# Altium project PowerBoard.PrjPCB (part 3 of 3)

## Sheet CurrentSens.SchDoc: Current Sensors
size A4; DrawnBy: Jarod Krane; Organization: Altium Limited; Address1: L3, 12a Rodborough Rd; Address2: Frenchs Forest; Address3: NSW; Address4: Australia 2086; Revision: 0; SheetNumber: 9; SheetTotal: 11
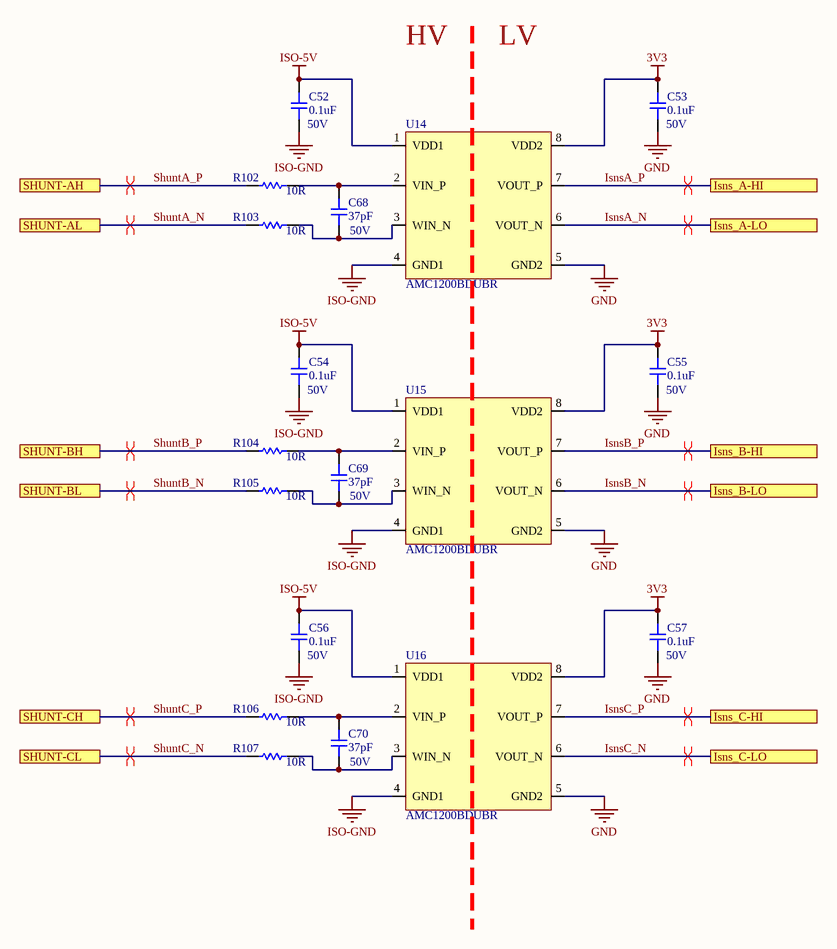
[diagram p10: CurrentSens.SchDoc]

### Parts
C52  0.1uF  Voltage: 50V  [CAP-0805]
C53  0.1uF  Voltage: 50V  [CAP-0805]
C54  0.1uF  Voltage: 50V  [CAP-0805]
C55  0.1uF  Voltage: 50V  [CAP-0805]
C56  0.1uF  Voltage Rating: 50V  [CAP-0805]
C57  0.1uF  Voltage: 50V  [CAP-0805]
C68  37pF  Voltage: 50V  [CAP-0805]
C69  37pF  Voltage: 50V  [CAP-0805]
C70  37pF  Voltage: 50V  [CAP-0805]
R102  10R  [RES-0603]
R103  10R  [RES-0603]
R104  10R  [RES-0603]
R105  10R  [RES-0603]
R106  10R  [RES-0603]
R107  10R  [RES-0603]
U14  AMC1200BDUBR  [8-SOP]
U15  AMC1200BDUBR  [8-SOP]
U16  AMC1200BDUBR  [8-SOP]

### Ports
Isns_A-HI, Isns_A-LO, Isns_B-HI, Isns_B-LO, Isns_C-HI, Isns_C-LO, SHUNT-AH, SHUNT-AL, SHUNT-BH, SHUNT-BL, SHUNT-CH, SHUNT-CL

### Nets
3V3: C53.2 C55.2 C57.2 U14.8(VDD2) U15.8(VDD2) U16.8(VDD2)
GND: C53.1 C55.1 C57.1 U14.5(GND2) U15.5(GND2) U16.5(GND2)
ISO-5V: C52.2 C54.2 C56.2 U14.1(VDD1) U15.1(VDD1) U16.1(VDD1)
ISO-GND: C52.1 C54.1 C56.1 U14.4(GND1) U15.4(GND1) U16.4(GND1)
IsnsA_N: U14.6(VOUT_N) ; port Isns_A-LO
IsnsA_P: U14.7(VOUT_P) ; port Isns_A-HI
IsnsB_N: U15.6(VOUT_N) ; port Isns_B-LO
IsnsB_P: U15.7(VOUT_P) ; port Isns_B-HI
IsnsC_N: U16.6(VOUT_N) ; port Isns_C-LO
IsnsC_P: U16.7(VOUT_P) ; port Isns_C-HI
ShuntA_N: R103.2 ; port SHUNT-AL
ShuntA_P: R102.2 ; port SHUNT-AH
ShuntB_N: R105.2 ; port SHUNT-BL
ShuntB_P: R104.2 ; port SHUNT-BH
ShuntC_N: R107.2 ; port SHUNT-CL
ShuntC_P: R106.2 ; port SHUNT-CH
NetC68_1: C68.1 R103.1 U14.3(WIN_N)
NetC68_2: C68.2 R102.1 U14.2(VIN_P)
NetC69_1: C69.1 R105.1 U15.3(WIN_N)
NetC69_2: C69.2 R104.1 U15.2(VIN_P)
NetC70_1: C70.1 R107.1 U16.3(WIN_N)
NetC70_2: C70.2 R106.1 U16.2(VIN_P)

### Layout directives
differential pair: IsnsA_N, IsnsA_P, IsnsB_N, IsnsB_P, IsnsC_N, IsnsC_P, ShuntA_N, ShuntA_P, ShuntB_N, ShuntB_P, ShuntC_N, ShuntC_P

### Notes on the sheet
- HV
- LV
- Title
- Size:
- Date:
- A4
- Number:
- Time:
- Revision:
- Sheet
- of
- File:

### Library data of the parts
C52-C57 = 0805-0.1uF-50V: CAP CER 0.1UF 50V Y5V 0805; Manufacturer: KEMET; Manufacturer Part Number: C0805C104Z5VACTU; Dielectric Material: Ceramic; Capacitance: 100nF; Tolerance: 80%; Dissipation Factor: 5%; Supplier 1: Digi-Key; Stock 1: 929243; Pricing 1: 1=0.1, 10=0.057, 100=0.0254, 500=0.01818, 1000=0.01428 (USD); Mount: Surface Mount,PCB; Case/Package: 0805; Number of Pins: 2; Case Code (Metric): 2012; Case Code (Imperial): 0805; Min Operating Temperature: -30°C; Max Operating Temperature: 85°C; Package Quantity: 1; Packaging: Tape and Reel; Voltage Rating (DC): 50V; Dielectric: Y5V; Termination: SMD/SMT; Length: 2mm; Height: 0.9mm; Lead Pitch: 0.75mm; Width: 0.049inch; Thickness: 0.039inch; Depth: 1.25mm; Radiation Hardening: No; REACH SVHC: No SVHC; Lead Free: Lead Free; ComponentLink1URL: http://www.alliedelec.com/m/d/9bfe7773041ffe9d406e68bc7b377fdd.pdf?src-supplier=Allied+Electronics; ComponentLink1Description: http://www.alliedelec.com/m/d/9bfe7773041ffe9d406e68bc7b377fdd.pdf?src-supplier=Allied+Electronics; ComponentLink2URL: https://www.verical.com/server-webapp/html/getDatasheet?partID=37101&src-supplier=Verical; ComponentLink2Description: https://www.verical.com/server-webapp/html/getDatasheet?partID=37101&src-supplier=Verical; ComponentLink3URL: https://www.verical.com/server-webapp/html/getDatasheet?partID=321176&src-supplier=Verical; ComponentLink3Description: https://www.verical.com/server-webapp/html/getDatasheet?partID=321176&src-supplier=Verical; ComponentLink4URL: http://www.farnell.com/datasheets/2123124.pdf?src-supplier=Element14; ComponentLink4Description: http://www.farnell.com/datasheets/2123124.pdf?src-supplier=Element14; Supplier Part Number 1: 399-1177-6-ND
  C52-C55 C57: Voltage Rating: 50V
  C56: Voltage: 50V
C68-C70 = 0805-39pF-50V: CAP CER 39PF 50V C0G/NP0 0805; Manufacturer: Samsung; Manufacturer Part Number: CL21C390JBANNNC; Material: Ceramic; Tolerance: 5%; Dielectric: C0G; Temperature Coefficient: 300ppm/°C; Supplier 1: Digi-Key; Stock 1: 62860; Pricing 1: 1=0.1, 10=0.045, 50=0.0248, 100=0.0202, 500=0.01444, 1000=0.01135 (USD); Mount: Surface Mount; Case/Package: 0805; Case Code (Metric): 2012; Case Code (Imperial): 0805; Min Operating Temperature: -55°C; Max Operating Temperature: 125°C; Package Quantity: 1; Packaging: Tape and Reel; Voltage Rating: 50V; Series: CL; Construction: Flat; Length: 2mm; Width: 0.049inch; Height: 0.65mm; Thickness: 0.03inch; Depth: 1.25mm; Radiation Hardening: No; RoHS Compliant: Yes; ComponentLink1URL: http://www1.futureelectronics.com/doc/SAMSUNG%20PASSIVE/CL05B104KQ5NNNC.pdf?src-supplier=Future+Electronics; ComponentLink1Description: http://www1.futureelectronics.com/doc/SAMSUNG%20PASSIVE/CL05B104KQ5NNNC.pdf?src-supplier=Future+Electronics; ComponentLink2URL: https://www.verical.com/server-webapp/html/getDatasheet?partID=480498&src-supplier=Verical; ComponentLink2Description: https://www.verical.com/server-webapp/html/getDatasheet?partID=480498&src-supplier=Verical; ComponentLink3URL: https://produktinfo.conrad.com/datenblaetter/450000-474999/454441-da-01-en-VS_KONDENSATOR_0805.pdf?src-supplier=Conrad; ComponentLink3Description: https://produktinfo.conrad.com/datenblaetter/450000-474999/454441-da-01-en-VS_KONDENSATOR_0805.pdf?src-supplier=Conrad; Supplier Part Number 1: 1276-1769-1-ND; Capacitance: 39pF
R102-R107 = 0603-10R: RES SMD 10 OHM 1% 1/10W 0603; Manufacturer: Yageo; Manufacturer Part Number: RC0603FR-0710RL; Voltage Rating (DC): 50V; Temperature Coefficient: 200ppm/°C; Power Rating: 100mW; Supplier 1: Digi-Key; Stock 1: 11151092; Pricing 1: 1=0.1, 10=0.046, 100=0.0187, 1000=0.0084, 2500=0.00729 (USD); Case/Package: 0603; Number of Pins: 2; Case Code (Imperial): 0603; Case Code (Metric): 1608; Contact Plating: Tin,Matte; Min Operating Temperature: -55°C; Max Operating Temperature: 155°C; Packaging: Tape and Reel; Resistance: 10R; Tolerance: 1%; Composition: Thick Film; Voltage Rating: 50V; Termination: SMD/SMT; Military Standard: Not; Length: 1.6mm; Height: 0.45mm; Width: 0.8mm; Depth: 0.8mm; Radiation Hardening: No; REACH SVHC: No SVHC; Lead Free: Lead Free; ComponentLink1URL: http://www.farnell.com/datasheets/1868787.pdf?src-supplier=Element14; ComponentLink1Description: http://www.farnell.com/datasheets/1868787.pdf?src-supplier=Element14; ComponentLink2URL: http://www.yageo.com/documents/recent/PYu-RC0603_51_RoHS_L_4.pdf?src-supplier=Avnet; ComponentLink2Description: http://www.yageo.com/documents/recent/PYu-RC0603_51_RoHS_L_4.pdf?src-supplier=Avnet; ComponentLink3URL: http://documents.rs-components.com/techlib://itc_doclist_GB.htm?stockno=5048984&src-supplier=RSComponents; ComponentLink3Description: http://documents.rs-components.com/techlib://itc_doclist_GB.htm?stockno=5048984&src-supplier=RSComponents; ComponentLink4URL: http://www.yageo.com/documents/recent/PYu-RC0603_51_RoHS_L_4.pdf?src-supplier=Avnet+Europe; ComponentLink4Description: http://www.yageo.com/documents/recent/PYu-RC0603_51_RoHS_L_4.pdf?src-supplier=Avnet+Europe; Supplier Part Number 1: 311-10.0HRDKR-ND
U14-U16 = ISO-OPAMP: IC OPAMP ISOLATION 1 CIRC 8SOP; Manufacturer: Texas Instruments; Number of Channels: 1; Common Mode Rejection Ratio: 95dB; Operating Supply Voltage: 5.5V; -3db Bandwidth: 100kHz; Nominal Supply Current: 5.4mA; Output Current: 20mA; Max Input Voltage: 320mV; Input Offset Voltage (Vos): 200uV; Power Dissipation: 44mW; Power Supply Rejection Ratio (PSRR): 61dB; Dual Supply Voltage: 5V; Power Consumption: 82.5mW; Supplier 1: Digi-Key; Manufacturer Part Number: AMC1200BDUBR; Stock 1: 0; Pricing 1: 1=4.92, 10=4.415, 25=4.1736, 100=3.6172 (USD); Mount: Surface Mount; Case/Package: SOP; Number of Pins: 8; Min Operating Temperature: -40°C; Max Operating Temperature: 105°C; Max Dual Supply Voltage: 5.5V; Packaging: Tape and Reel; Package Quantity: 350; Bandwidth: 100kHz; Number of Circuits: 1; Operating Supply Current: 5.4mA; Output Current per Channel: 20mA; Max Power Dissipation: 44mW; Number of Elements: 1; Series: -; Amplifier Type: ISOLATION; Supply Current: 5.4mA; Lead Free: Lead Free; RoHS Compliant: Yes; ComponentLink1URL: http://www.ti.com/general/docs/lit/getliterature.tsp?genericPartNumber=AMC1200&&fileType=pdf&src-supplier=Avnet; ComponentLink1Description: http://www.ti.com/general/docs/lit/getliterature.tsp?genericPartNumber=AMC1200&&fileType=pdf&src-supplier=Avnet; ComponentLink2URL: http://www.ti.com/lit/ds/symlink/amc1200.pdf?src-supplier=Digi-Key; ComponentLink2Description: http://www.ti.com/lit/ds/symlink/amc1200.pdf?src-supplier=Digi-Key; Supplier Part Number 1: 296-38868-6-ND

## Nets that join several sheets
3V3: Sensors (C51.2 U13.8), Connectors (J2.17), CurrentSens (6 pins)
5V: PhaseALeg (6 pins), PhaseBLeg (6 pins), PhaseCLeg (6 pins), Sensors (R40.2 R41.2 R42.2), Connectors (J2.7 J2.19)
12V: PhaseALeg (C2.2 C10.2 U1.1 U3.1), PhaseBLeg (C18.2 C26.2 U5.1 U7.1), PhaseCLeg (C34.2 C43.2 U9.1 U11.1), AIRControl (C59.2 U18.5), Connectors (J2.9 J2.21)
GND: PhaseALeg (10 pins), PhaseBLeg (10 pins), PhaseCLeg (10 pins), Sensors (5 pins), AIRControl (C59.1 U18.3), Connectors (7 pins), CurrentSens (6 pins)
HV+: U_PhaseALeg/HA (7 pins), U_PhaseBLeg/HB (7 pins), U_PhaseCLeg/HC (7 pins), Sensors (R50.2), AIRControl (8 pins), Connectors (7 pins)
HV-GND: PhaseALeg (C66.2 R4.1), PhaseBLeg (C67.2 R17.1), PhaseCLeg (C39.2 R30.1), Sensors (R51.1 U13.3), AIRControl (Q22.3 R60.1), Connectors (7 pins)
ISO-5V: Sensors (C50.2 U13.1), Connectors (J7.2), CurrentSens (6 pins)
ISO-GND: Sensors (C50.1 U13.4), Connectors (J7.1), CurrentSens (6 pins)
A-HI-CLAMP: PhaseALeg (U2.6), U_PhaseALeg/HA (14 pins)
A-HI-GATE: PhaseALeg (U2.7), U_PhaseALeg/HA (7 pins)
A-HIGH: PhaseALeg (R2.1 R6.1), Connectors (J2.3)
A-LO-CLAMP: PhaseALeg (U4.6), U_PhaseALeg/LA (14 pins)
A-LO-GATE: PhaseALeg (U4.7), U_PhaseALeg/LA (7 pins)
A-LOW: PhaseALeg (R3.1 R5.1), Connectors (J2.4)
B-HI-CLAMP: PhaseBLeg (U6.6), U_PhaseBLeg/HB (14 pins)
B-HI-GATE: PhaseBLeg (U6.7), U_PhaseBLeg/HB (7 pins)
B-HIGH: PhaseBLeg (R15.1 R19.1), Connectors (J2.16)
B-LO-CLAMP: PhaseBLeg (U8.6), U_PhaseBLeg/LB (14 pins)
B-LO-GATE: PhaseBLeg (U8.7), U_PhaseBLeg/LB (7 pins)
B-LOW: PhaseBLeg (R16.1 R18.1), Connectors (J2.15)
C-HI-CLAMP: PhaseCLeg (U10.6), U_PhaseCLeg/HC (14 pins)
C-HI-GATE: PhaseCLeg (U10.7), U_PhaseCLeg/HC (7 pins)
C-HIGH: PhaseCLeg (R28.1 R32.1), Connectors (J2.29)
C-LO-CLAMP: PhaseCLeg (U12.6), U_PhaseCLeg/LC (14 pins)
C-LO-GATE: PhaseCLeg (U12.7), U_PhaseCLeg/LC (7 pins)
C-LOW: PhaseCLeg (R29.1 R31.1), Connectors (J2.30)
IsnsA_N: Connectors (J2.2), CurrentSens (U14.6)
IsnsA_P: Connectors (J2.1), CurrentSens (U14.7)
IsnsB_N: Connectors (J2.14), CurrentSens (U15.6)
IsnsB_P: Connectors (J2.13), CurrentSens (U15.7)
IsnsC_N: Connectors (J2.28), CurrentSens (U16.6)
IsnsC_P: Connectors (J2.27), CurrentSens (U16.7)
NetC15_1: PhaseALeg (C15.1 C16.2 R4.2), U_PhaseALeg/LA (7 pins)
NetC31_1: PhaseBLeg (C31.1 C32.2 R17.2), U_PhaseBLeg/LB (7 pins)
NetC48_1: PhaseCLeg (C48.1 C49.2 R30.2), U_PhaseCLeg/LC (7 pins)
Phase-A-OUT: PhaseALeg (C7.1 C8.2), U_PhaseALeg/HA (7 pins), U_PhaseALeg/LA (7 pins), Connectors (J4.1)
Phase-B-OUT: PhaseBLeg (C23.1 C24.2), U_PhaseBLeg/HB (7 pins), U_PhaseBLeg/LB (7 pins), Connectors (J5.1)
Phase-C-OUT: PhaseCLeg (C40.1 C41.2), U_PhaseCLeg/HC (7 pins), U_PhaseCLeg/LC (7 pins), Connectors (J6.1)
ShuntA_N: PhaseALeg (R4.3), CurrentSens (R103.2)
ShuntA_P: PhaseALeg (R4.4), CurrentSens (R102.2)
ShuntB_N: PhaseBLeg (R17.3), CurrentSens (R105.2)
ShuntB_P: PhaseBLeg (R17.4), CurrentSens (R104.2)
ShuntC_N: PhaseCLeg (R30.3), CurrentSens (R107.2)
ShuntC_P: PhaseCLeg (R30.4), CurrentSens (R106.2)
Shutdown: AIRControl (U18.2), Connectors (J2.12)
TEMP1: Sensors (R40.1 R45.2), Connectors (J2.25)
TEMP2: Sensors (R41.1 R46.2), Connectors (J2.11)
TEMP3: Sensors (R42.1 R47.2), Connectors (J2.5)
Vsns_N: Sensors (U13.6), Connectors (J2.23)
Vsns_P: Sensors (U13.7), Connectors (J2.26)